# EAGLE design tinyduino-breakout-mk-1.0 (EAGLE 6.5.0)
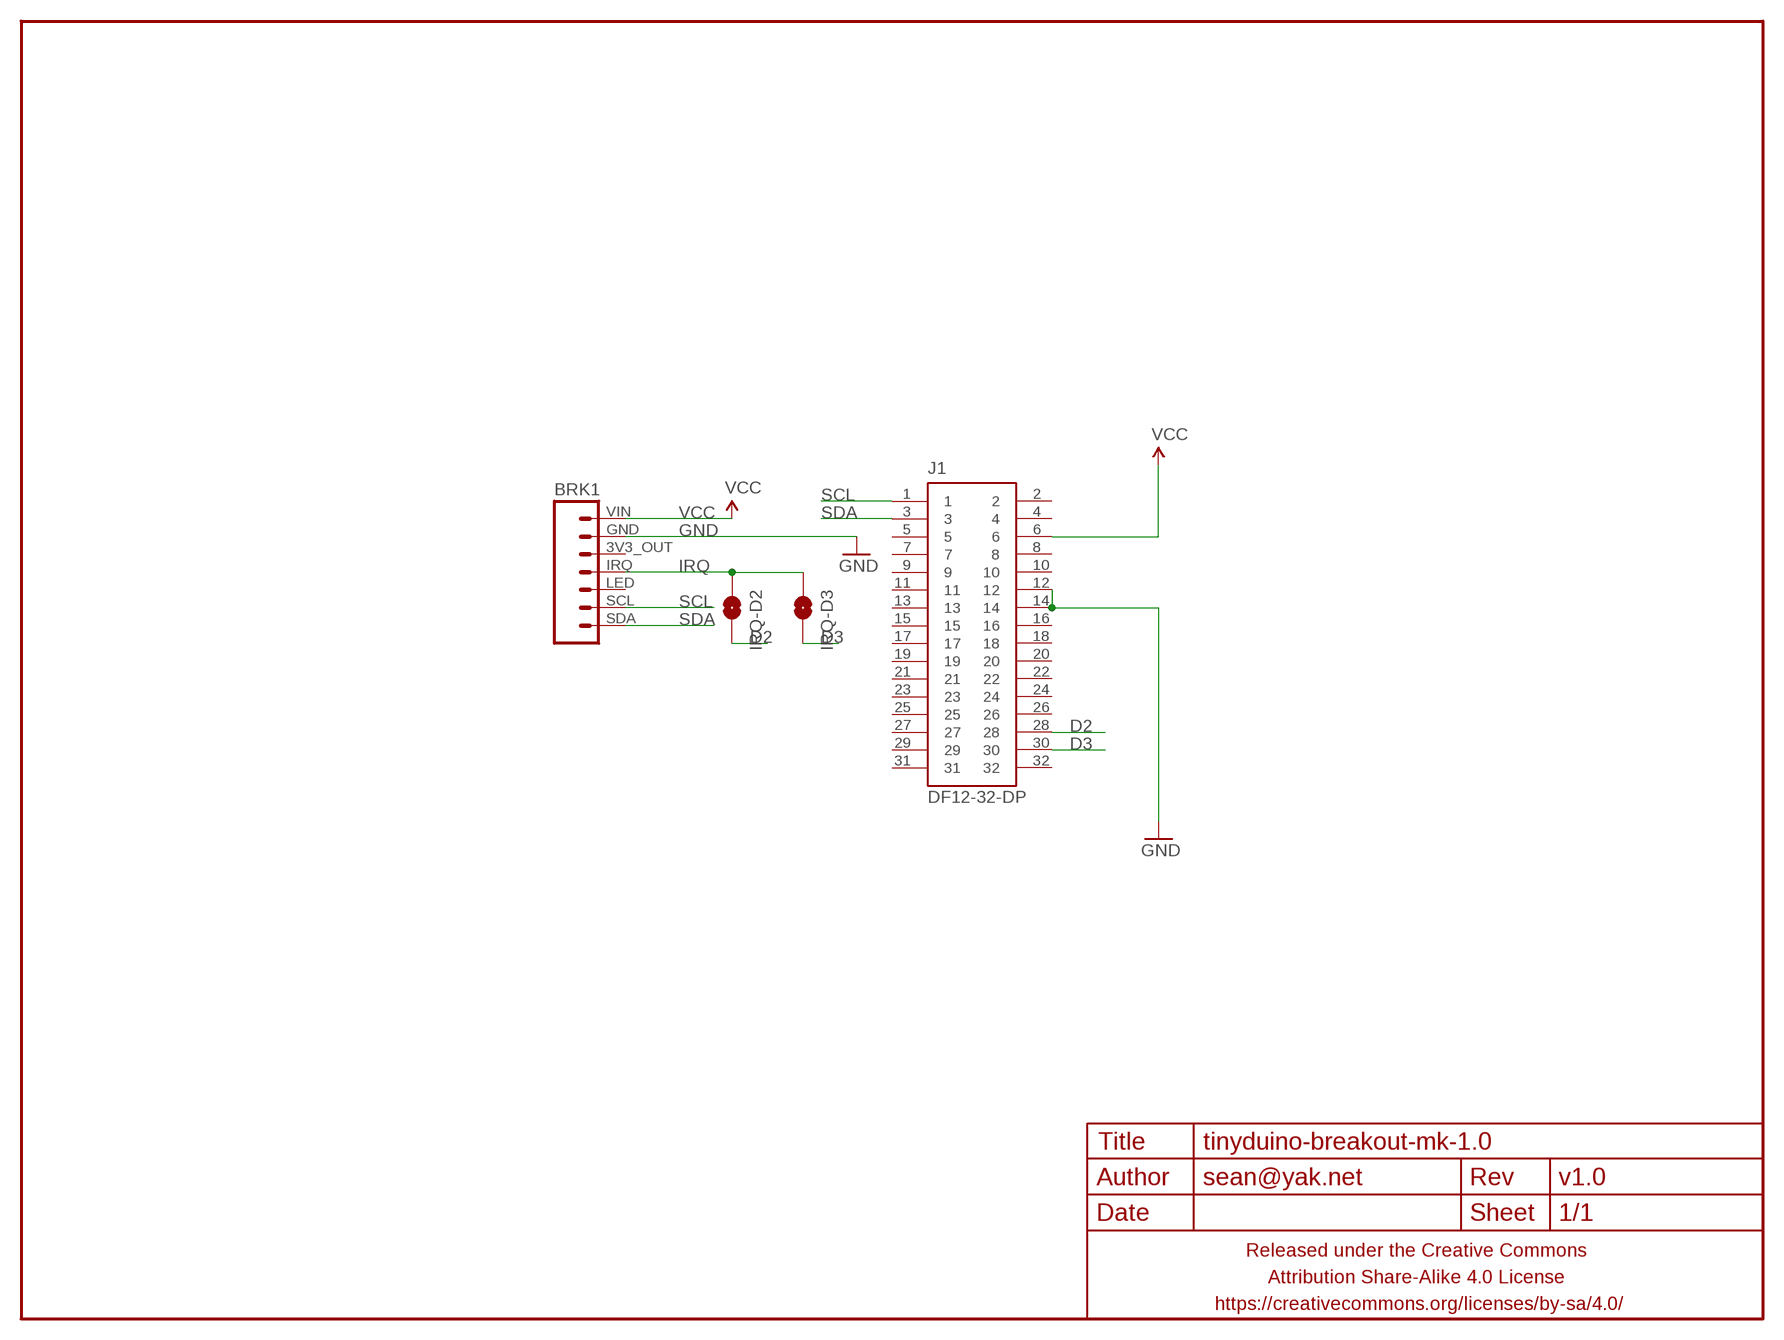
[diagram p0: schematic, sheet 1]

## Parts
BRK1  ADAFRUIT-SI1145-BREAKOUT  [ADAFRUIT-SI1145-BREAKOUT]
FRAME1  FRAME-LETTERNO_PACKAGE  [DUMMY]
IRQ-D2  JUMPER-PAD-2-NOYES_SILK  [PAD-JUMPER-2-NO_YES_SILK]
IRQ-D3  JUMPER-PAD-2-NOYES_SILK  [PAD-JUMPER-2-NO_YES_SILK]
J1  DF12-32-DP  AS-ITM-00015  [DF12-32-DP]

## Nets
D2: IRQ-D2.2 J1.28
D3: IRQ-D3.2 J1.30
GND: BRK1.GND J1.12 J1.14
IRQ: BRK1.IRQ IRQ-D2.1 IRQ-D3.1
SCL: BRK1.SCL J1.1
SDA: BRK1.SDA J1.3
VCC: BRK1.VIN J1.6
Unconnected: BRK1.3V3_OUT BRK1.LED J1.2 J1.4 J1.5 J1.7 J1.8 J1.9 J1.10 J1.11 J1.13 J1.15 J1.16 J1.17 J1.18 J1.19 J1.20 J1.21 J1.22 J1.23 J1.24 J1.25 J1.26 J1.27 J1.29 J1.31 J1.32

## Library data of the parts
BRK1 = A_butts:ADAFRUIT-SI1145-BREAKOUT
FRAME1 = A_butts:FRAME-LETTER: Schematic Frame Standard 8.5x11 US Letter frame; DESIGNER: sean@yak.net; VERSION: v1.0
IRQ-D2 IRQ-D3 = A_butts:JUMPER-PAD-2-NO
J1 = A_butts:AS-ITM-00015: CONN HEADER 32POS 3MM SMD 0.5MM; PARTNO: AS-ITM-00015

## Board
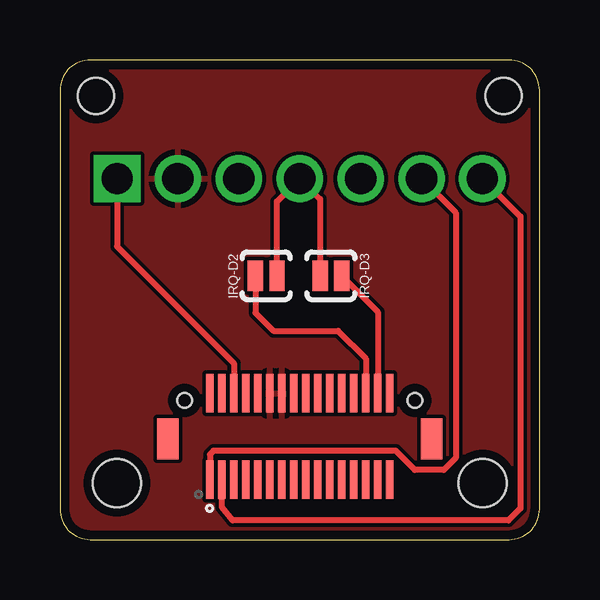
[diagram p1: board, top side]
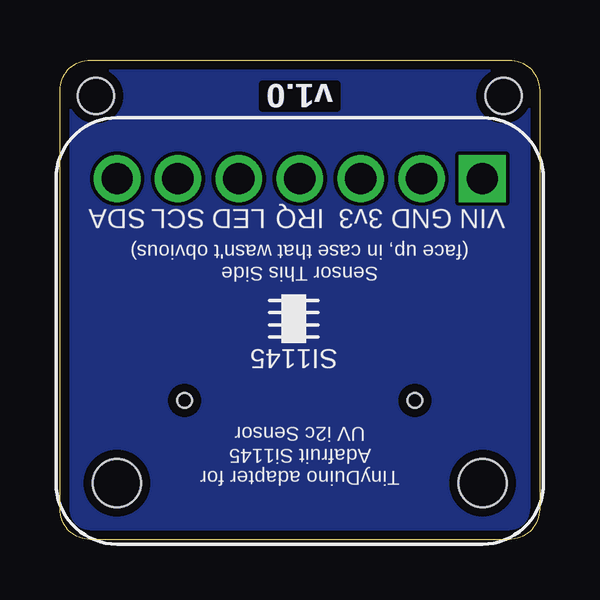
[diagram p2: board, bottom side, seen from below]

Size 20 x 20 mm. Coordinates in mm from the lower left corner, seen from the top.
Outline: 0,18.73 0,1.27 arc90 1.27,0 18.73,0 arc90 20,1.27 20,18.73 arc90 18.73,20 1.27,20 arc90 0,18.73
Copper layers (1*16): Top 0.0356mm / dielectric 1.5011mm / Bottom 0.0356mm
Design rules "LaenPCBOrder_2": minimum track width 6mil, minimum drill 13mil, track to track 6mil, track to pad 6mil, pad to pad 6mil, via to via 6mil, smd to smd 6mil, copper to edge 15mil, drill to drill 6mil, minimum pad ring 7mil, minimum via ring 7mil, stop-mask expansion 3mil, vias tented up to drill 20mil, thermal gap 10mil
Holes 1.5 mm at 1.5,18.5 18.5,18.5

### Footprints (pad centres in the part's own frame; a part is rotated, then mirrored left to right if it is on the bottom)
ADAFRUIT-SI1145-BREAKOUT = drill 1.3 pad 1.93: 3V3_OUT -2.54,-6.35; GND -5.08,-6.35; IRQ 0,-6.35; LED 2.54,-6.35; SCL 5.08,-6.35; SDA 7.62,-6.35 | drill 1.3 pad 1.93 square: VIN -7.62,-6.35 | hole 2: -7.62,6.35; 7.62,6.35
PAD-JUMPER-2-NO_YES_SILK = smd 0.635 x 1.27: 1 -0.45,0; 2 0.45,0
DF12-32-DP = smd 0.3 x 1.6: 1 -3.75,-1.8; 2 -3.75,1.8; 3 -3.25,-1.8; 4 -3.25,1.8; 5 -2.75,-1.8; 6 -2.75,1.8; 7 -2.25,-1.8; 8 -2.25,1.8; 9 -1.75,-1.8; 10 -1.75,1.8; 11 -1.25,-1.8; 12 -1.25,1.8; 13 -0.75,-1.8; 14 -0.75,1.8; 15 -0.25,-1.8; 16 -0.25,1.8; 17 0.25,-1.8; 18 0.25,1.8; 19 0.75,-1.8; 20 0.75,1.8; 21 1.25,-1.8; 22 1.25,1.8; 23 1.75,-1.8; 24 1.75,1.8; 25 2.25,-1.8; 26 2.25,1.8; 27 2.75,-1.8; 28 2.75,1.8; 29 3.25,-1.8; 30 3.25,1.8; 31 3.75,-1.8; 32 3.75,1.8 | smd 0.9 x 1.7: F1 -5.5,-0.1; F2 5.5,-0.1 | hole 0.6: -4.8,1.5; 4.8,1.5

### Placement (x,y rotation side)
BRK1  10,8.7 180 bottom
FRAME1  0,-0.5 0 top
IRQ-D2  8.6,11 180 top
IRQ-D3  11.3,11 0 top
J1  10,4.3 0 top

### Tracks (layer width: path | path; a pad name or v marks a point on that pad's centre or on a via)
D2
  Top 0.254: IRQ-D2.2 8.15,9.45 8.9,8.7 11.6,8.7 12.75,7.55 J1.28
D3
  Top 0.254: IRQ-D3.2 13.25,9.5 J1.30
GND
  pour Top: 0,20 20,20 20,0 0,0
GND1
  pour Bottom: 18.73,0 1.27,0 arc-90 0,1.27 0,18.73 arc-90 1.27,20 18.73,20 arc-90 20,18.73 20,1.27 arc-90
IRQ
  Top 0.254: IRQ-D3.1 10.85,14.2 BRK1.IRQ 9.05,14.1 IRQ-D2.1
SCL
  Top 0.254: BRK1.SCL 16.5,13.63 16.5,3.4 16,2.9 14.8,2.9 14,3.7 6.4,3.7 6.25,3.55 J1.1
SDA
  Top 0.254: BRK1.SDA 19.2,13.47 19.2,1.3 18.7,0.8 7.2,0.8 6.75,1.35 J1.3
VCC
  Top 0.254: BRK1.VIN 2.38,12.22 7.25,7.35 J1.6

### Text on the board
bPlace: Sensor This Side / (face up, in case that wasn't obvious) | TinyDuino adapter for / Adafruit Si1145 / UV i2c Sensor